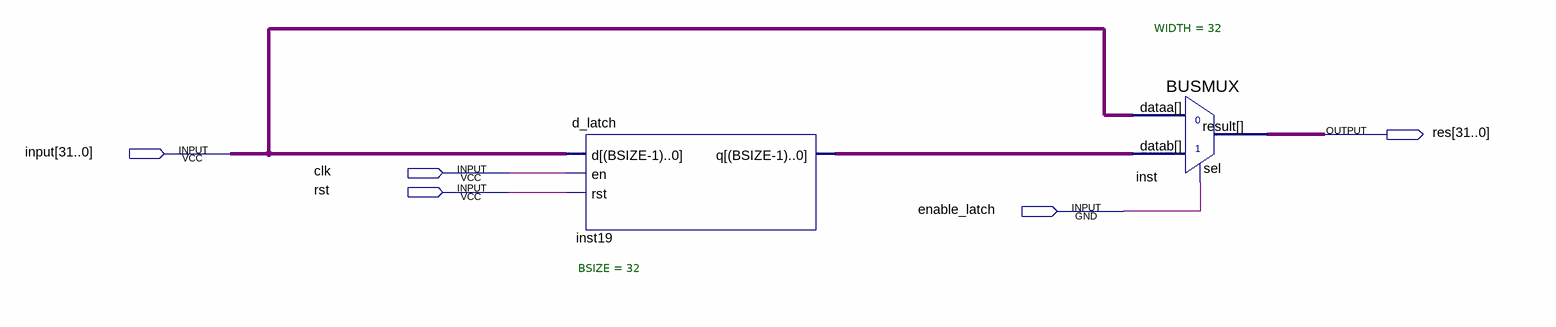
[diagram p0: schematic sheet]
// Quartus schematic stage_divider.bdf as structural Verilog: 2 symbols, 5 pins
module stage_divider (
  input  [31:0] \input ,
  input  clk,
  input  rst,
  input  enable_latch,
  output [31:0] res
);

  wire [31:0] inst19_q;

  d_latch #(.BSIZE(32)) inst19 (.d(\input ), .en(clk), .rst(rst), .q(inst19_q));
  BUSMUX #(.WIDTH(32)) inst (.datab(inst19_q), .sel(enable_latch), .dataa(\input ), .result(res));
endmodule
